# Altium schematic sheet llrf_afe_dds.SchDoc
size 209 x 297 mm; SheetNumber: 8; SheetTotal: 12
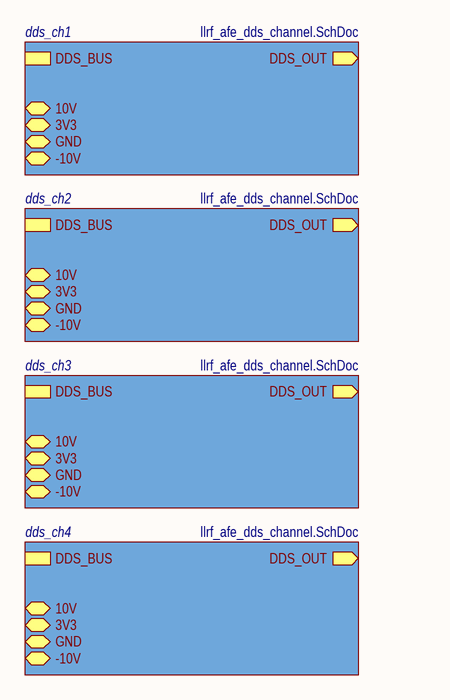
[diagram p0: llrf_afe_dds.SchDoc]

## Sub-sheets
dds_ch1 = llrf_afe_dds_channel.SchDoc: GND (bidir), 3V3 (bidir), DDS_OUT (out), 10V (bidir), -10V (bidir), DDS_BUS (harness DDS_BUS)
dds_ch2 = llrf_afe_dds_channel.SchDoc: GND (bidir), 3V3 (bidir), DDS_OUT (out), 10V (bidir), -10V (bidir), DDS_BUS (harness DDS_BUS)
dds_ch3 = llrf_afe_dds_channel.SchDoc: GND (bidir), 3V3 (bidir), DDS_OUT (out), 10V (bidir), -10V (bidir), DDS_BUS (harness DDS_BUS)
dds_ch4 = llrf_afe_dds_channel.SchDoc: GND (bidir), 3V3 (bidir), DDS_OUT (out), 10V (bidir), -10V (bidir), DDS_BUS (harness DDS_BUS)

## Notes on the sheet
- Подп. и дата
- Инв. № дубл.
- Взам. инв. №
- Инв. № подл.
- Изм.
- Лист
- № докум.
- Подп.
- Дата
- Форма 2а ГОСТ 2.104-2006
- Копировал
- Формат А4